# Altium schematic sheet main.SchDoc
size A3; SheetNumber: 1; SheetTotal: 2
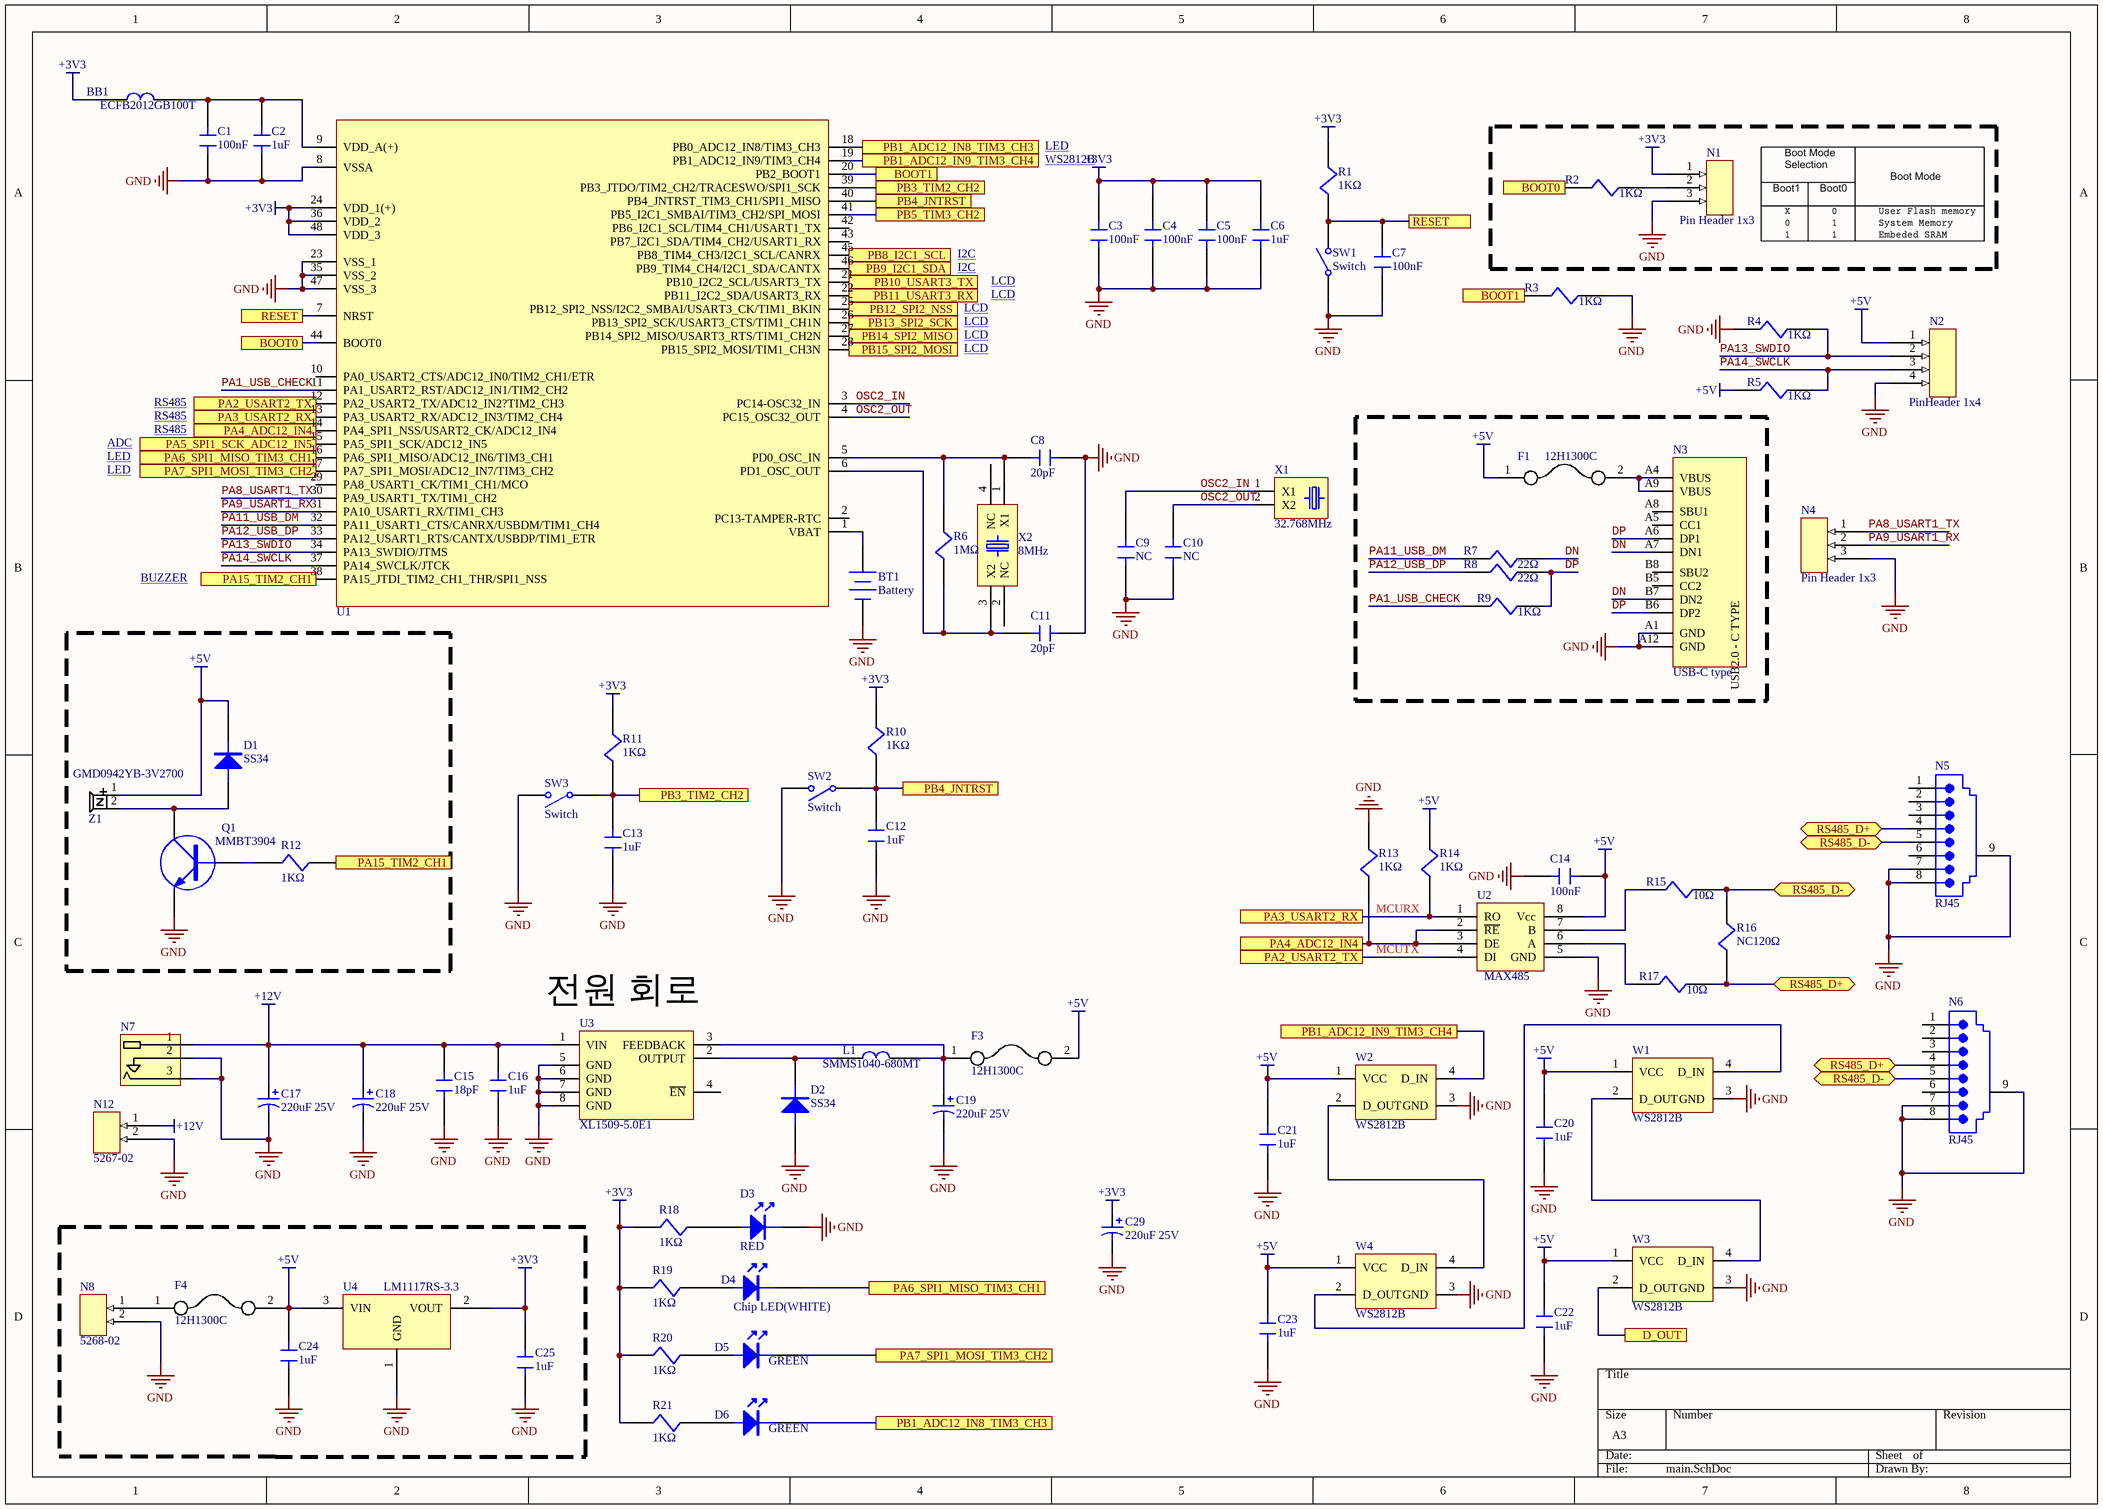
[diagram p0: main.SchDoc]

## Parts
BB1  Part Number: ECFB2012GB100T  [2012-L]  (hidden comment: BEAD)
BT1  Battery  [CR2032_SMD]
C1  Part Number: 100nF  [1608-C]  (hidden comment: Chip Capacitor)
C2  Part Number: 1uF  [1608-C]  (hidden comment: Chip Capacitor)
C3  Part Number: 100nF  [1608-C]  (hidden comment: Chip Capacitor)
C4  Part Number: 100nF  [1608-C]  (hidden comment: Chip Capacitor)
C5  Part Number: 100nF  [1608-C]  (hidden comment: Chip Capacitor)
C6  Part Number: 1uF  [1608-C]  (hidden comment: Chip Capacitor)
C7  Part Number: 100nF  [1608-C]  (hidden comment: Chip Capacitor)
C8  Part Number: 20pF  [1608-C]  (hidden comment: Chip Capacitor)
C9  Part Number: NC  [1608-C]  (hidden comment: Chip Capacitor)
C10  Part Number: NC  [1608-C]  (hidden comment: Chip Capacitor)
C11  Part Number: 20pF  [1608-C]  (hidden comment: Chip Capacitor)
C12  Part Number: 1uF  [1608-C]  (hidden comment: Chip Capacitor)
C13  Part Number: 1uF  [1608-C]  (hidden comment: Chip Capacitor)
C14  Part Number: 100nF  [1608-C]  (hidden comment: Chip Capacitor)
C15  Part Number: 18pF  [1608-C]  (hidden comment: Chip Capacitor)
C16  Part Number: 1uF  [1608-C]  (hidden comment: Chip Capacitor)
C17  Part Number: 220uF 25V  [CAP_8X10]  (hidden comment: Capacitor)
C18  Part Number: 220uF 25V  [CAP_8X10]  (hidden comment: Capacitor)
C19  Part Number: 220uF 25V  [CAP_8X10]  (hidden comment: Capacitor)
C20  Part Number: 1uF  [1608-C]  (hidden comment: Chip Capacitor)
C21  Part Number: 1uF  [1608-C]  (hidden comment: Chip Capacitor)
C22  Part Number: 1uF  [1608-C]  (hidden comment: Chip Capacitor)
C23  Part Number: 1uF  [1608-C]  (hidden comment: Chip Capacitor)
C24  Part Number: 1uF  [1608-C]  (hidden comment: Chip Capacitor)
C25  Part Number: 1uF  [1608-C]  (hidden comment: Chip Capacitor)
C29  Part Number: 220uF 25V  [CAP_8X10]  (hidden comment: Capacitor)
D1  DIODE  [SS34]  (value not drawn)
D2  DIODE  [SS34]  (value not drawn)
D3  Part Number: RED  [1608-LED]  (hidden comment: Chip LED)
D4  Part Number: Chip LED(WHITE)  [1608-LED]  (hidden comment: LED)
D5  Part Number: GREEN  [1608-LED]  (hidden comment: Chip LED)
D6  Part Number: GREEN  [1608-LED]  (hidden comment: Chip LED)
F1  Part Number: 12H1300C  [CCP2E30]  (hidden comment: Chip Fuse)
F3  Part Number: 12H1300C  [CCP2E30]  (hidden comment: Chip Fuse)
F4  Part Number: 12H1300C  [CCP2E30]  (hidden comment: Chip Fuse)
L1  Part Number: SMMS1040-680MT  [inductor_10x40]  (hidden comment: IND1)
N1  Part Number: Pin Header 1x3  [jumper3]  (hidden comment: Connector)
N2  Part Number: PinHeader 1x4  [jumper4]  (hidden comment: Connector)
N3  USB-C type  [USB_C_2.0]
N4  Part Number: Pin Header 1x3  [jumper3]  (hidden comment: Conector)
N5  RJ45  [RJ45-PCB830]
N6  RJ45  [RJ45-PCB830]
N7  (no value)  [DC JACK_3.5pi - duplicate]
N8  CONNECTOR  [5268-02]  (value not drawn)
N12  CONNECTOR  [5267-02]  (value not drawn)
Q1  Part Number: MMBT3904  [SOT-23TR]  (hidden comment: NPN TR)
R1  Part Number: 1KΩ  [1608-R]  (hidden comment: Chip Resistor)
R2  Part Number: 1KΩ  [1608-R]  (hidden comment: Chip Resistor)
R3  Part Number: 1KΩ  [1608-R]  (hidden comment: Chip Resistor)
R4  Part Number: 1KΩ  [1608-R]  (hidden comment: Chip Resistor)
R5  Part Number: 1KΩ  [1608-R]  (hidden comment: Chip Resistor)
R6  Part Number: 1MΩ  [1608-R]  (hidden comment: Chip Resistor)
R7  Part Number: 22Ω  [1608-R]  (hidden comment: Chip Resistor)
R8  Part Number: 22Ω  [1608-R]  (hidden comment: Chip Resistor)
R9  Part Number: 1KΩ  [1608-R]  (hidden comment: Chip Resistor)
R10  Part Number: 1KΩ  [1608-R]  (hidden comment: Chip Resistor)
R11  Part Number: 1KΩ  [1608-R]  (hidden comment: Chip Resistor)
R12  Part Number: 1KΩ  [1608-R]  (hidden comment: Chip Resistor)
R13  Part Number: 1KΩ  [1608-R]  (hidden comment: Chip Resistor)
R14  Part Number: 1KΩ  [1608-R]  (hidden comment: Chip Resistor)
R15  Part Number: 10Ω  [1608-R]  (hidden comment: Chip Resistor)
R16  Part Number: NC120Ω  [1608-R]  (hidden comment: Chip Resistor)
R17  Part Number: 10Ω  [1608-R]  (hidden comment: Chip Resistor)
R18  Part Number: 1KΩ  [1608-R]  (hidden comment: Chip Resistor)
R19  Part Number: 1KΩ  [1608-R]  (hidden comment: Chip Resistor)
R20  Part Number: 1KΩ  [1608-R]  (hidden comment: Chip Resistor)
R21  Part Number: 1KΩ  [1608-R]  (hidden comment: Chip Resistor)
SW1  Switch  [TACT_Micro]
SW2  Switch  [TACT_Micro]
SW3  Switch  [TACT_Micro]
U1  MCU  [LQFP-48]  (value not drawn)
U2  Part Number: MAX485  [SO-8]  (hidden comment: Driver)
U3  Part Number: XL1509-5.0E1  [SOIC-8]  (hidden comment: Buck Converter)
U4  Part Number: LM1117RS-3.3  [D-PAK_TO252]  (hidden comment: Regulator)
W1  LED  [WS2812B _Mini]  (value not drawn)
W2  LED  [WS2812B _Mini]  (value not drawn)
W3  LED  [WS2812B _Mini]  (value not drawn)
W4  LED  [WS2812B _Mini]  (value not drawn)
X1  32.768MHz  [XTAL_2012]
X2  Part Number: 8MHz  [XTAL3225]  (hidden comment: CRYSTAL)
Z1  GMD0942YB-3V2700  [Buzzer_9mm]

## Ports
BOOT0, BOOT1, D_OUT, PA2_USART2_TX, PA3_USART2_RX, PA4_ADC12_IN4, PA5_SPI1_SCK_ADC12_IN5, PA6_SPI1_MISO_TIM3_CH1, PA7_SPI1_MOSI_TIM3_CH2, PA15_TIM2_CH1, PB1_ADC12_IN8_TIM3_CH3, PB1_ADC12_IN9_TIM3_CH4, PB3_TIM2_CH2, PB4_JNTRST, PB5_TIM3_CH2, PB8_I2C1_SCL, PB9_I2C1_SDA, PB10_USART3_TX, PB11_USART3_RX, PB12_SPI2_NSS, PB13_SPI2_SCK, PB14_SPI2_MISO, PB15_SPI2_MOSI, RESET, RS485_D+ (bidir), RS485_D- (bidir)

## Nets
+3V3: BB1.1 C3.1 C4.1 C5.1 C6.2 C25.2 C29.1 N1.1 R1.1 R10.2 R11.2 R18.2 R19.2 R20.2 R21.2 U1.24(VDD_1(+)) U1.36(VDD_2) U1.48(VDD_3) U4.2(VOUT)
+5V: C14.1 C20.2 C21.2 C22.2 C23.2 C24.2 D1.2(K) F1.1 F3.2 F4.2 N2.1 R5.1 R14.2 U2.8(Vcc) U4.3(VIN) W1.1(VCC) W2.1(VCC) W3.1(VCC) W4.1(VCC) Z1.1(VCC)
+12V: C15.2 C16.2 C17.1 C18.1 N7.1 N12.1 U3.1(VIN)
GND: BT1.2(-) C1.2 C2.1 C3.2 C4.2 C5.2 C6.1 C7.2 C8.2 C9.1 C10.1 C11.2 C12.2 C13.2 C14.2 C15.1 C16.1 C17.2 C18.2 C19.2 C20.1 C21.1 C22.1 C23.1 C24.1 C25.1 C29.2 D2.1(A) D3.2 N1.3 N2.4 N3.A1(GND) N3.A12(GND) N4.3 N5.7 N5.8 N5.9(G) N6.7 N6.8 N6.9(G) N7.2 N7.3 N8.2 N12.2 Q1.3(E) R3.1 R4.1 R13.2 SW1.1(COMMON) SW2.2(NO) SW3.2(NO) U1.8(VSSA) U1.23(VSS_1) U1.35(VSS_2) U1.47(VSS_3) U2.5(GND) U3.5(GND) U3.6(GND) U3.7(GND) U3.8(GND) U4.1(GND) W1.3(GND) W2.3(GND) W3.3(GND) W4.3(GND)
BOOT0: R2.2 U1.44(BOOT0) ; port BOOT0
BOOT1: R3.2 U1.20(PB2_BOOT1) ; port BOOT1
D_OUT: W3.2(D_OUT) ; port D_OUT
DN: N3.A7(DN1) N3.B7(DN2) R7.1
DP: N3.A6(DP1) N3.B6(DP2) R8.1 R9.2
OSC2_IN: C9.2 U1.3(PC14-OSC32_IN) X1.1(X1)
OSC2_OUT: C10.2 U1.4(PC15_OSC32_OUT) X1.2(X2)
PA1_USB_CHECK: R9.1 U1.11(PA1_USART2_RST/ADC12_IN1/TIM2_CH2)
PA2_USART2_TX: U1.12(PA2_USART2_TX/ADC12_IN2?TIM2_CH3) U2.4(DI) ; port PA2_USART2_TX
PA3_USART2_RX: R14.1 U1.13(PA3_USART2_RX/ADC12_IN3/TIM2_CH4) U2.1(RO) ; port PA3_USART2_RX
PA4_ADC12_IN4: R13.1 U1.14(PA4_SPI1_NSS/USART2_CK/ADC12_IN4) U2.2(~{RE}) U2.3(DE) ; port PA4_ADC12_IN4
PA5_SPI1_SCK_ADC12_IN5: U1.15(PA5_SPI1_SCK/ADC12_IN5) ; port PA5_SPI1_SCK_ADC12_IN5
PA6_SPI1_MISO_TIM3_CH1: D4.2 U1.16(PA6_SPI1_MISO/ADC12_IN6/TIM3_CH1) ; port PA6_SPI1_MISO_TIM3_CH1
PA7_SPI1_MOSI_TIM3_CH2: D5.2 U1.17(PA7_SPI1_MOSI/ADC12_IN7/TIM3_CH2) ; port PA7_SPI1_MOSI_TIM3_CH2
PA8_USART1_TX: N4.1 U1.30(PA9_USART1_TX/TIM1_CH2)
PA9_USART1_RX: N4.2 U1.31(PA10_USART1_RX/TIM1_CH3)
PA11_USB_DM: R7.2 U1.32(PA11_USART1_CTS/CANRX/USBDM/TIM1_CH4)
PA12_USB_DP: R8.2 U1.33(PA12_USART1_RTS/CANTX/USBDP/TIM1_ETR)
PA13_SWDIO: N2.2 R4.2 U1.34(PA13_SWDIO/JTMS)
PA14_SWCLK: N2.3 R5.2 U1.37(PA14_SWCLK/JTCK)
PA15_TIM2_CH1: R12.1 U1.38(PA15_JTDI_TIM2_CH1_THR/SPI1_NSS) ; port PA15_TIM2_CH1
PB1_ADC12_IN8_TIM3_CH3: D6.2 U1.18(PB0_ADC12_IN8/TIM3_CH3) ; port PB1_ADC12_IN8_TIM3_CH3
PB1_ADC12_IN9_TIM3_CH4: U1.19(PB1_ADC12_IN9/TIM3_CH4) W2.4(D_IN) ; port PB1_ADC12_IN9_TIM3_CH4
PB3_TIM2_CH2: C13.1 R11.1 SW3.1(COMMON) U1.39(PB3_JTDO/TIM2_CH2/TRACESWO/SPI1_SCK) ; port PB3_TIM2_CH2
PB4_JNTRST: C12.1 R10.1 SW2.1(COMMON) U1.40(PB4_JNTRST_TIM3_CH1/SPI1_MISO) ; port PB4_JNTRST
PB5_TIM3_CH2: U1.41(PB5_I2C1_SMBAI/TIM3_CH2/SPI_MOSI) ; port PB5_TIM3_CH2
PB8_I2C1_SCL: U1.45(PB8_TIM4_CH3/I2C1_SCL/CANRX) ; port PB8_I2C1_SCL
PB9_I2C1_SDA: U1.46(PB9_TIM4_CH4/I2C1_SDA/CANTX) ; port PB9_I2C1_SDA
PB10_USART3_TX: U1.21(PB10_I2C2_SCL/USART3_TX) ; port PB10_USART3_TX
PB11_USART3_RX: U1.22(PB11_I2C2_SDA/USART3_RX) ; port PB11_USART3_RX
PB12_SPI2_NSS: U1.25(PB12_SPI2_NSS/I2C2_SMBAI/USART3_CK/TIM1_BKIN) ; port PB12_SPI2_NSS
PB13_SPI2_SCK: U1.26(PB13_SPI2_SCK/USART3_CTS/TIM1_CH1N) ; port PB13_SPI2_SCK
PB14_SPI2_MISO: U1.27(PB14_SPI2_MISO/USART3_RTS/TIM1_CH2N) ; port PB14_SPI2_MISO
PB15_SPI2_MOSI: U1.28(PB15_SPI2_MOSI/TIM1_CH3N) ; port PB15_SPI2_MOSI
RESET: C7.1 R1.2 SW1.2(NO) U1.7(NRST) ; port RESET
RS485_D+: N5.4 N6.4 R16.1 R17.2 ; port RS485_D+
RS485_D-: N5.5 N6.5 R15.2 R16.2 ; port RS485_D-
NetBB1_2: BB1.2 C1.1 C2.2 U1.9(VDD_A(+))
NetBT1_1: BT1.1(+) U1.1(VBAT)
NetC8_1: C8.1 R6.1 U1.5(PD0_OSC_IN) X2.1(X1)
NetC11_1: C11.1 R6.2 U1.6(PD1_OSC_OUT) X2.3(X2)
NetC19_1: C19.1 F3.1 L1.2 U3.3(FEEDBACK)
NetD1_1: D1.1(A) Q1.2(C) Z1.2(VCC)
NetD2_2: D2.2(K) L1.1 U3.2(OUTPUT)
NetD3_1: D3.1 R18.1
NetD4_1: D4.1 R19.1
NetD5_1: D5.1 R20.1
NetD6_1: D6.1 R21.1
NetF1_2: F1.2 N3.A4(VBUS) N3.A9(VBUS)
NetF4_1: F4.1 N8.1
NetN1_2: N1.2 R2.1
NetQ1_1: Q1.1(B) R12.2
NetR15_1: R15.1 U2.7(B)
NetR17_1: R17.1 U2.6(A)
NetW1_2: W1.2(D_OUT) W3.4(D_IN)
NetW1_4: W1.4(D_IN) W4.2(D_OUT)
NetW2_2: W2.2(D_OUT) W4.4(D_IN)

Not connected (* = marked no-connect by the designer): N3 A5(CC1) A8(SBU1) B5(CC2) B8(SBU2); N5 1 2 3 6; N6 1 2 3 6; U1 2(PC13-TAMPER-RTC) 10(PA0_USART2_CTS/ADC12_IN0/TIM2_CH1/ETR) 29(PA8_USART1_CK/TIM1_CH1/MCO) 42(PB6_I2C1_SCL/TIM4_CH1/USART1_TX) 43(PB7_I2C1_SDA/TIM4_CH2/USART1_RX); U3 4(~{EN}); X2 2(NC) 4(NC)

## Notes on the sheet
- LED <ㅕk변경>
- WS2812B <ㅕk변경>
- I2C <ㅕk변경>
- LCD <ㅕk변경>
- ADC <ㅕk변경>
- RS485 <ㅕk변경>
- BUZZER <ㅕk변경>
- MCURX
- MCUTX
- (near U3) 전원 회로
- (in symbol USB-C 2.0) USB2.0 - C TYPE

## Library data of the parts
BB1 = IND1: 2012 type Bead
BT1 = Battery: Multicell Battery; Published: 24-Mar-1999; LatestRevisionDate: 17-Jul-2002; LatestRevisionNote: Re-released for DXP Platform.; PackageReference: BAT-2; Publisher: Altium Limited; PackageDescription: Battery; 2 Leads
C1-C16 C20-C25 = CAP: Capacitor, 1608 type
  C1 C3-C5 C7 C14: LCSC: C14663
  C2 C6 C12 C13 C16 C20-C25: LCSC: C15849
  C8 C11: LCSC: C1648
  C9 C10: LCSC: NC
  C15: LCSC: C1647
C17-C19 C29 = Cap Pol1: TanTal Capacitor; LCSC: C311610
D3 D5 D6 = LED: LED 1608. SMD
  D3: LCSC: C72044
  D5 D6: LCSC: C72043
D4 = LED: Green, 1608. SMD; LCSC: C34499
F1 F3 F4 = FUSE_CHIP: Chip Fuse 3216; LCSC: C182445; URL: https://jlcpcb.com/parts/componentSearch?secondSortUuid=e97bd0f3124c47c588b72c76ed31e691&name=Surface%20Mount%20Fuses&firstSortUuid=f346e0c6c2c44c2495c3d3e7077cf5f1
L1 = IND1: Chip Inductor; LCSC: C286354
N1 N4 = CON3: Pin Header; LCSC: C429954
N2 = CON4: Pin Header; LCSC: C124378
N3 = USB-C 2.0: USB2.0-C type; Part Number: U262-161N-4BVC11; URL: https://www.eleparts.co.kr/goods/view?no=8137725; LCSC: C165948
N7 = DC_JACK
N8 N12 = CON2: Molex
  N8: Part Number: 5268-02
  N12: Part Number: 5267-02
Q1 = TR(NPN): Transistor; LCSC: C20526
R1-R9 R15-R17 = RES1: Resistor, 1608 type; Value: 10KΩ
  R1-R5 R9: LCSC: C21190
  R6: LCSC: C22935
  R7 R8: LCSC: C1203
  R15 R17: LCSC: C22859
R10-R14 R18-R21 = RES1: Resistor, 1608 type; LCSC: C21190
SW1-SW3 = SW-SPST: Single-Pole, Single-Throw Switch; Published: 24-Mar-1999; LatestRevisionDate: 17-Jul-2002; LatestRevisionNote: Re-released for DXP Platform.; PackageReference: SPST-2; Publisher: Altium Limited; PackageDescription: Switch; 2 Leads; LCSC: C720477
U1 = STM32F103_LQFP64: ARM-based 32bit MCU
U2 = MAX485-SO8: RS485 Driver; LCSC: C23492
U3 = XL1509_FIX: 2A 150KHz 40V Buck DC to DC Converter; LCSC: C61063; ComponentLink1Description: URL; ComponentLink1URL: https://datasheet.lcsc.com/szlcsc/1809050422_XLSEMI-XL1509-5-0E1_C61063.pdf
U4 = 7803(SOT-223): LM1117-3.3 / 3.3V OUT / MAX 1A; LCSC: C126023
W1-W4 = WS2812B: DC 5V / 60mA WS2812B; LCSC: C114583; ComponentLink1Description: URL; ComponentLink1URL: https://lcsc.com/product-detail/Light-Emitting-Diodes-LED_5050-RGBIntegrated-Light-4Pin_C114586.html/?href=jlc-SMT; Part Number: WS2812B
X1 = XTAL_2: Crystal; Part Number: Q13FC1350000400; Temp: -40 ~ 85; LCSC: C32346; ComponentLink1Description: URL; ComponentLink1URL: https://datasheet.lcsc.com/szlcsc/1811151451_Seiko-SC-20S-32-768kHz-20PPM-7pF_C97602.pdf
X2 = XTAL_5: 8MHz  3X5 CERAMIC SMD CRYSTAL; LCSC: C157341
Z1 = BUZZER: 피에조 부저; Part Number: GMD0942YB-3V2700; URL: https://www.devicemart.co.kr/goods/view?no=1361184; LCSC: C252932
D1 D2 = DIODE: Part Number: SS34; LCSC: C8678